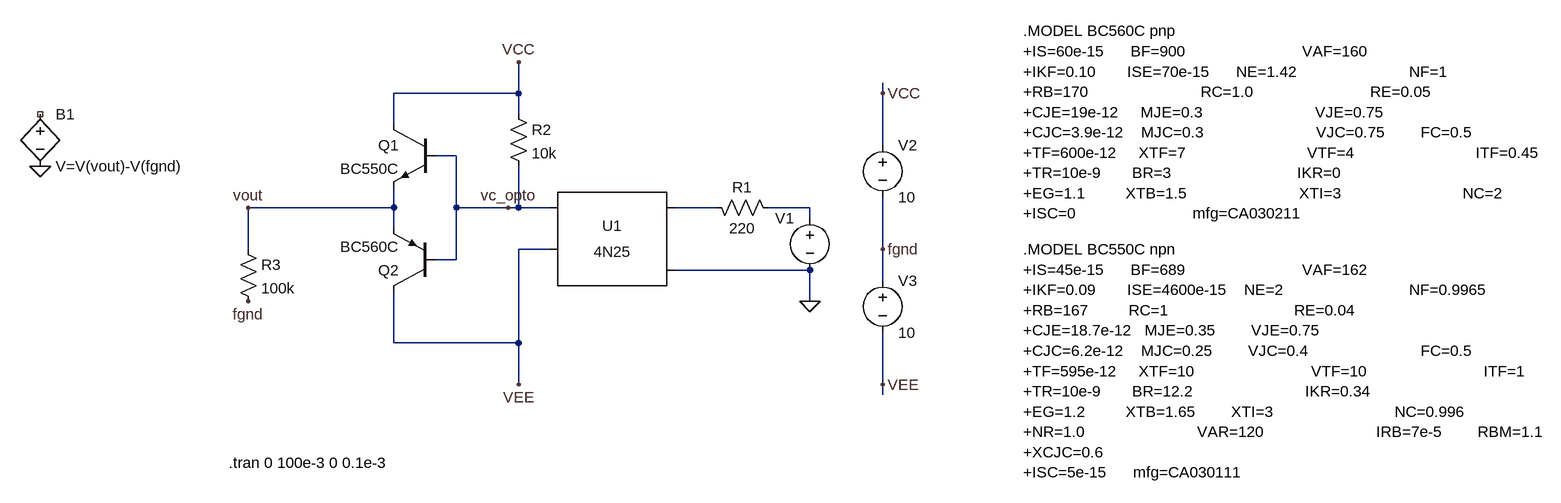
[diagram p0: schematic optocoupler_test.asc]
optocoupler_test.asc, the LTspice schematic file:
Version 4
SHEET 1 880 680
WIRE -1344 -272 -1344 -320
WIRE -1344 -272 -1536 -272
WIRE -784 -272 -784 -288
WIRE -1344 -240 -1344 -272
WIRE -1536 -224 -1536 -272
WIRE -784 -192 -784 -272
WIRE -1440 -176 -1472 -176
WIRE -1536 -96 -1536 -128
WIRE -1536 -96 -1760 -96
WIRE -1440 -96 -1440 -176
WIRE -1360 -96 -1440 -96
WIRE -1344 -96 -1344 -160
WIRE -1344 -96 -1360 -96
WIRE -1296 -96 -1344 -96
WIRE -1040 -96 -1104 -96
WIRE -896 -96 -960 -96
WIRE -896 -80 -896 -96
WIRE -1536 -64 -1536 -96
WIRE -1760 -32 -1760 -96
WIRE -1296 -32 -1344 -32
WIRE -784 -32 -784 -112
WIRE -1440 -16 -1440 -96
WIRE -1440 -16 -1472 -16
WIRE -896 0 -1104 0
WIRE -784 16 -784 -32
WIRE -896 48 -896 0
WIRE -1536 112 -1536 32
WIRE -1344 112 -1344 -32
WIRE -1344 112 -1536 112
WIRE -1344 176 -1344 112
WIRE -784 176 -784 96
WIRE -784 192 -784 176
FLAG -896 48 0
FLAG -784 -32 fgnd
FLAG -784 -272 VCC
FLAG -784 176 VEE
FLAG -1344 176 VEE
FLAG -1344 -320 VCC
FLAG -1360 -96 vc_opto
FLAG -1760 48 fgnd
FLAG -2080 -160 0
FLAG -1760 -96 vout
SYMBOL res -1056 -112 M90
WINDOW 0 0 56 VBottom 2
WINDOW 3 32 56 VTop 2
SYMATTR InstName R1
SYMATTR Value 220
SYMBOL voltage -896 -96 M0
WINDOW 3 24 96 Invisible 2
WINDOW 123 0 0 Left 0
WINDOW 39 0 0 Left 0
SYMATTR Value PULSE(0 3.3 5e-3 1e-9 1e-9 10e-3 20e-3 3)
SYMATTR InstName V1
SYMBOL voltage -784 -208 R0
WINDOW 123 0 0 Left 0
WINDOW 39 0 0 Left 0
SYMATTR InstName V2
SYMATTR Value 10
SYMBOL voltage -784 0 R0
WINDOW 123 0 0 Left 0
WINDOW 39 0 0 Left 0
SYMATTR InstName V3
SYMATTR Value 10
SYMBOL res -1360 -256 R0
SYMATTR InstName R2
SYMATTR Value 10k
SYMBOL npn -1472 -224 M0
SYMATTR InstName Q1
SYMATTR Value BC550C
SYMBOL pnp -1472 32 R180
SYMATTR InstName Q2
SYMATTR Value BC560C
SYMBOL Optos\\4N25 -1200 -32 M0
SYMATTR InstName U1
SYMBOL res -1776 -48 R0
SYMATTR InstName R3
SYMATTR Value 100k
SYMBOL bv -2080 -256 R0
SYMATTR InstName B1
SYMATTR Value V=V(vout)-V(fgnd)
TEXT -568 -368 Left 2 !.MODEL BC560C pnp\n+IS=60e-15      BF=900                          VAF=160\n+IKF=0.10       ISE=70e-15      NE=1.42                         NF=1\n+RB=170                         RC=1.0                          RE=0.05\n+CJE=19e-12     MJE=0.3                         VJE=0.75\n+CJC=3.9e-12    MJC=0.3                         VJC=0.75        FC=0.5\n+TF=600e-12     XTF=7                           VTF=4                           ITF=0.45\n+TR=10e-9       BR=3                            IKR=0\n+EG=1.1         XTB=1.5                         XTI=3                           NC=2\n+ISC=0                          mfg=CA030211
TEXT -568 -32 Left 2 !.MODEL BC550C npn\n+IS=45e-15      BF=689                          VAF=162\n+IKF=0.09       ISE=4600e-15    NE=2                            NF=0.9965\n+RB=167         RC=1                            RE=0.04\n+CJE=18.7e-12   MJE=0.35        VJE=0.75\n+CJC=6.2e-12    MJC=0.25        VJC=0.4                         FC=0.5\n+TF=595e-12     XTF=10                          VTF=10                          ITF=1\n+TR=10e-9       BR=12.2                         IKR=0.34\n+EG=1.2         XTB=1.65        XTI=3                           NC=0.996\n+NR=1.0                         VAR=120                         IRB=7e-5        RBM=1.1\n+XCJC=0.6       \n+ISC=5e-15      mfg=CA030111
TEXT -1790 296 Left 2 !.tran 0 100e-3 0 0.1e-3

The netlist it stands for:
* optocoupler_test.asc
R1 N001 N002 220
V1 N002 0 PULSE(0 3.3 5e-3 1e-9 1e-9 10e-3 20e-3 3)
V2 VCC fgnd 10
V3 fgnd VEE 10
R2 VCC vc_opto 10k
Q1 VCC vc_opto vout 0 BC550C
Q2 VEE vc_opto vout 0 BC560C
XU1 N001 0 vc_opto VEE NC_01 4N25
R3 vout fgnd 100k
B1 NC_02 0 V=V(vout)-V(fgnd)
.model NPN NPN
.model PNP PNP
.lib standard.bjt
.MODEL BC560C pnp
+IS=60e-15      BF=900                          VAF=160
+IKF=0.10       ISE=70e-15      NE=1.42                         NF=1
+RB=170                         RC=1.0                          RE=0.05
+CJE=19e-12     MJE=0.3                         VJE=0.75
+CJC=3.9e-12    MJC=0.3                         VJC=0.75        FC=0.5
+TF=600e-12     XTF=7                           VTF=4                           ITF=0.45
+TR=10e-9       BR=3                            IKR=0
+EG=1.1         XTB=1.5                         XTI=3                           NC=2
+ISC=0                          mfg=CA030211
.MODEL BC550C npn
+IS=45e-15      BF=689                          VAF=162
+IKF=0.09       ISE=4600e-15    NE=2                            NF=0.9965
+RB=167         RC=1                            RE=0.04
+CJE=18.7e-12   MJE=0.35        VJE=0.75
+CJC=6.2e-12    MJC=0.25        VJC=0.4                         FC=0.5
+TF=595e-12     XTF=10                          VTF=10                          ITF=1
+TR=10e-9       BR=12.2                         IKR=0.34
+EG=1.2         XTB=1.65        XTI=3                           NC=0.996
+NR=1.0                         VAR=120                         IRB=7e-5        RBM=1.1
+XCJC=0.6
+ISC=5e-15      mfg=CA030111
.tran 0 100e-3 0 0.1e-3
.lib 4N25.sub
.backanno
.end